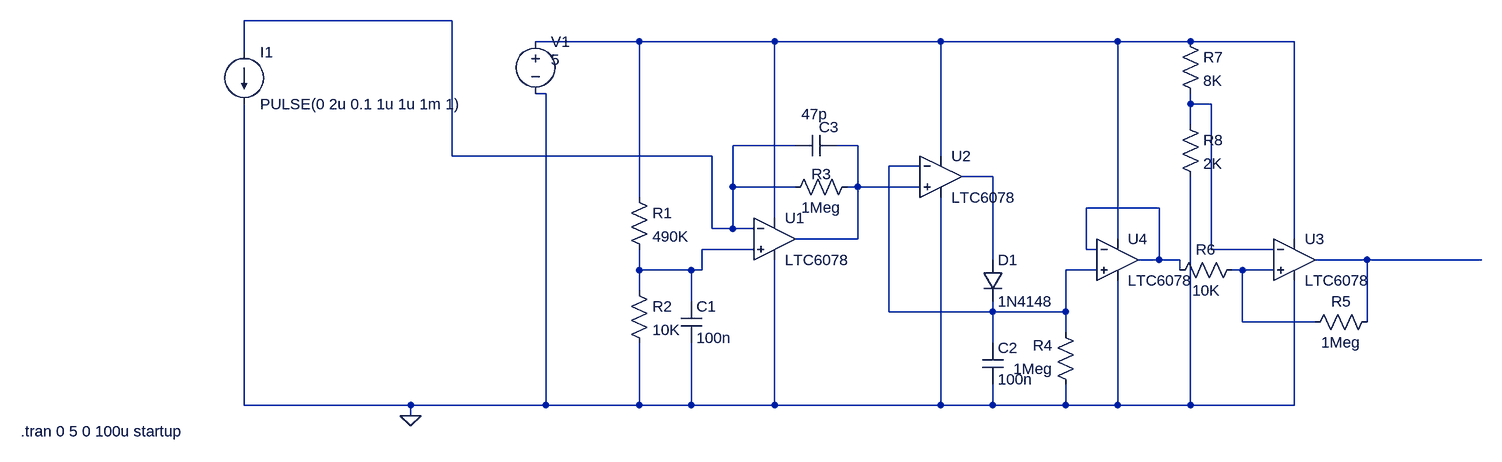
[diagram p0: schematic Amplifier,PeakDetectorandComparator.asc]
Amplifier,PeakDetectorandComparator.asc, the LTspice schematic file:
Version 4.1
SHEET 1 1140 680
WIRE -448 -240 -768 -240
WIRE -160 -208 -320 -208
WIRE 48 -208 -160 -208
WIRE 304 -208 48 -208
WIRE 576 -208 304 -208
WIRE 688 -208 576 -208
WIRE 848 -208 688 -208
WIRE -768 -192 -768 -240
WIRE -304 -128 -320 -128
WIRE 688 -112 688 -128
WIRE 720 -112 688 -112
WIRE 688 -80 688 -112
WIRE 80 -48 -16 -48
WIRE 176 -48 144 -48
WIRE -448 -32 -448 -240
WIRE -48 -32 -448 -32
WIRE 304 -32 304 -208
WIRE 272 -16 224 -16
WIRE 384 0 336 0
WIRE -16 16 -16 -48
WIRE 80 16 -16 16
WIRE 176 16 176 -48
WIRE 176 16 160 16
WIRE 272 16 176 16
WIRE -160 32 -160 -208
WIRE 640 48 528 48
WIRE 48 64 48 -208
WIRE -48 80 -48 -32
WIRE -16 80 -16 16
WIRE -16 80 -48 80
WIRE 16 80 -16 80
WIRE 176 96 176 16
WIRE 176 96 80 96
WIRE 576 96 576 -208
WIRE 848 96 848 -208
WIRE 16 112 -64 112
WIRE 528 112 528 48
WIRE 544 112 528 112
WIRE 720 112 720 -112
WIRE 816 112 720 112
WIRE 384 128 384 0
WIRE 640 128 640 48
WIRE 640 128 608 128
WIRE 672 128 640 128
WIRE 960 128 880 128
WIRE 1136 128 960 128
WIRE -160 144 -160 112
WIRE -80 144 -160 144
WIRE -64 144 -64 112
WIRE -64 144 -80 144
WIRE 544 144 496 144
WIRE 672 144 672 128
WIRE 768 144 752 144
WIRE 816 144 768 144
WIRE -160 176 -160 144
WIRE -80 192 -80 144
WIRE 224 208 224 -16
WIRE 384 208 384 192
WIRE 384 208 224 208
WIRE 496 208 496 144
WIRE 496 208 384 208
WIRE 768 224 768 144
WIRE 880 224 768 224
WIRE 960 224 960 128
WIRE 496 240 496 208
WIRE 384 256 384 208
WIRE -768 352 -768 -112
WIRE -512 352 -768 352
WIRE -304 352 -304 -128
WIRE -304 352 -512 352
WIRE -160 352 -160 256
WIRE -160 352 -304 352
WIRE -80 352 -80 256
WIRE -80 352 -160 352
WIRE 48 352 48 128
WIRE 48 352 -80 352
WIRE 304 352 304 32
WIRE 304 352 48 352
WIRE 384 352 384 320
WIRE 384 352 304 352
WIRE 496 352 496 320
WIRE 496 352 384 352
WIRE 576 352 576 160
WIRE 576 352 496 352
WIRE 688 352 688 0
WIRE 688 352 576 352
WIRE 848 352 848 160
WIRE 848 352 688 352
WIRE -512 368 -512 352
FLAG -512 368 0
SYMBOL OpAmps\\LTC6078 48 96 R0
SYMATTR InstName U1
SYMBOL OpAmps\\LTC6078 304 0 R0
SYMATTR InstName U2
SYMBOL OpAmps\\LTC6078 848 128 R0
SYMATTR InstName U3
SYMBOL voltage -320 -224 R0
WINDOW 3 24 44 Left 2
WINDOW 123 0 0 Left 0
WINDOW 39 0 0 Left 0
SYMATTR InstName V1
SYMATTR Value 5
SYMBOL res -176 16 R0
SYMATTR InstName R1
SYMATTR Value 490K
SYMBOL res -176 160 R0
SYMATTR InstName R2
SYMATTR Value 10K
SYMBOL res 176 0 R90
WINDOW 0 12 56 VBottom 2
WINDOW 3 32 56 VTop 2
SYMATTR InstName R3
SYMATTR Value 1Meg
SYMBOL res 512 336 R180
WINDOW 0 36 76 Left 2
WINDOW 3 36 40 Left 2
SYMATTR InstName R4
SYMATTR Value 1Meg
SYMBOL cap -96 192 R0
SYMATTR InstName C1
SYMATTR Value 100n
SYMBOL cap 368 256 R0
SYMATTR InstName C2
SYMATTR Value 100n
SYMBOL cap 144 -64 R90
WINDOW 0 3 12 VBottom 2
WINDOW 3 -48 34 VTop 2
SYMATTR InstName C3
SYMATTR Value 47p
SYMBOL diode 368 128 R0
SYMATTR InstName D1
SYMATTR Value 1N4148
SYMBOL res 656 160 R270
WINDOW 0 32 56 VTop 2
WINDOW 3 0 56 VBottom 2
SYMATTR InstName R6
SYMATTR Value 10K
SYMBOL current -768 -192 R0
WINDOW 123 0 0 Left 0
WINDOW 39 0 0 Left 0
SYMATTR InstName I1
SYMATTR Value PULSE(0 2u 0.1 1u 1u 1m 1)
SYMBOL res 672 -224 R0
SYMATTR InstName R7
SYMATTR Value 8K
SYMBOL res 672 -96 R0
SYMATTR InstName R8
SYMATTR Value 2K
SYMBOL OpAmps\\LTC6078 576 128 R0
SYMATTR InstName U4
SYMBOL res 864 240 R270
WINDOW 0 32 56 VTop 2
WINDOW 3 0 56 VBottom 2
SYMATTR InstName R5
SYMATTR Value 1Meg
TEXT -1112 392 Left 2 !.tran 0 5 0 100u startup

The netlist it stands for:
* Amplifier,PeakDetectorandComparator.asc
X§U1 N008 N001 N002 0 N004 LTC6078  ; pins IN+ IN- VCC VEE OUT
X§U2 N004 N005 N002 0 N006 LTC6078  ; pins IN+ IN- VCC VEE OUT
X§U3 N010 N003 N002 0 N009 LTC6078  ; pins IN+ IN- VCC VEE OUT
V1 N002 0 5
R1 N002 N008 490K
R2 N008 0 10K
R3 N004 N001 1Meg
R4 0 N005 1Meg
C1 N008 0 100n
C2 N005 0 100n
C3 N004 N001 47p
D1 N006 N005 1N4148
R6 N007 N010 10K
I1 N001 0 PULSE(0 2u 0.1 1u 1u 1m 1)
R7 N002 N003 8K
R8 N003 0 2K
X§U4 N005 N007 N002 0 N007 LTC6078  ; pins IN+ IN- VCC VEE OUT
R5 N010 N009 1Meg
.model D D
.lib standard.dio
.tran 0 5 0 100u startup
.lib LTC5.lib
.backanno
.end